# Altium project BLE_Holder.PrjPcb
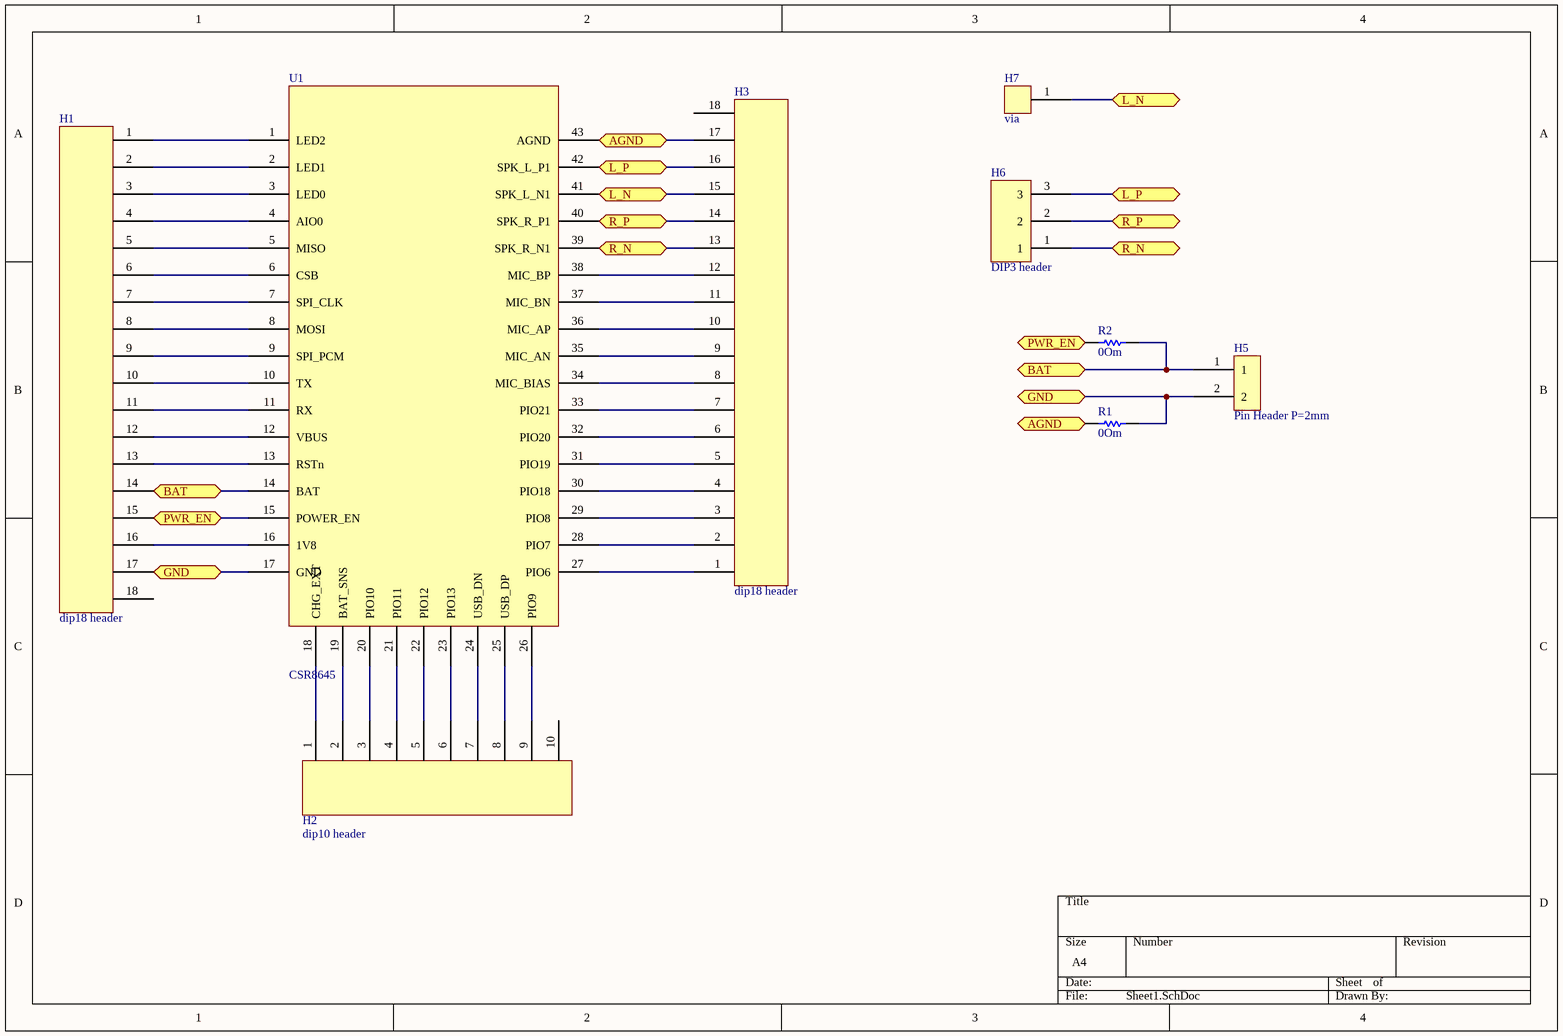
[diagram p0: Sheet1.SchDoc]
1 sheet, 9 parts. Net scope: flat (ports and power ports of the same name join across sheets).
Board file: PCB1.PcbDoc

## Sheet Sheet1.SchDoc
size A4

### Parts
H1  dip18 header  [dip18 header]
H2  dip10 header  [dip10 header]
H3  dip18 header  [dip18 header]
H5  Pin Header P=2mm  [Pin Header P=2mm]
H6  DIP3 header  [DIP3]
H7  via  [via]
R1  0Om  [RESC1608X55X30ML20T10]
R2  0Om  [RESC1608X55X30ML20T10]
U1  CSR8645  [CSR8645]

### Ports
AGND (bidir), BAT (bidir), GND (bidir), L_N (bidir), L_P (bidir), PWR_EN (bidir), R_N (bidir), R_P (bidir)

### Nets
NetH1_1: H1.1 U1.1(LED2)
NetH1_2: H1.2 U1.2(LED1)
NetH1_3: H1.3 U1.3(LED0)
NetH1_4: H1.4 U1.4(AIO0)
NetH1_5: H1.5 U1.5(MISO)
NetH1_6: H1.6 U1.6(CSB)
NetH1_7: H1.7 U1.7(SPI_CLK)
NetH1_8: H1.8 U1.8(MOSI)
NetH1_9: H1.9 U1.9(SPI_PCM)
NetH1_10: H1.10 U1.10(TX)
NetH1_11: H1.11 U1.11(RX)
NetH1_12: H1.12 U1.12(VBUS)
NetH1_13: H1.13 U1.13(RSTn)
NetH1_14: H1.14 H5.1 R2.2 U1.14(BAT) ; port BAT
NetH1_15: H1.15 R2.1 U1.15(POWER_EN) ; port PWR_EN
NetH1_16: H1.16 U1.16(1V8)
NetH1_17: H1.17 H5.2 R1.2 U1.17(GND) ; port GND
NetH2_1: H2.1 U1.18(CHG_EXT)
NetH2_2: H2.2 U1.19(BAT_SNS)
NetH2_3: H2.3 U1.20(PIO10)
NetH2_4: H2.4 U1.21(PIO11)
NetH2_5: H2.5 U1.22(PIO12)
NetH2_6: H2.6 U1.23(PIO13)
NetH2_7: H2.7 U1.24(USB_DN)
NetH2_8: H2.8 U1.25(USB_DP)
NetH2_9: H2.9 U1.26(PIO9)
NetH3_1: H3.1 U1.27(PIO6)
NetH3_2: H3.2 U1.28(PIO7)
NetH3_3: H3.3 U1.29(PIO8)
NetH3_4: H3.4 U1.30(PIO18)
NetH3_5: H3.5 U1.31(PIO19)
NetH3_6: H3.6 U1.32(PIO20)
NetH3_7: H3.7 U1.33(PIO21)
NetH3_8: H3.8 U1.34(MIC_BIAS)
NetH3_9: H3.9 U1.35(MIC_AN)
NetH3_10: H3.10 U1.36(MIC_AP)
NetH3_11: H3.11 U1.37(MIC_BN)
NetH3_12: H3.12 U1.38(MIC_BP)
NetH3_13: H3.13 H6.1 U1.39(SPK_R_N1) ; port R_N
NetH3_14: H3.14 H6.2 U1.40(SPK_R_P1) ; port R_P
NetH3_15: H3.15 H7.1 U1.41(SPK_L_N1) ; port L_N
NetH3_16: H3.16 H6.3 U1.42(SPK_L_P1) ; port L_P
NetH3_17: H3.17 R1.1 U1.43(AGND) ; port AGND

Not connected (* = marked no-connect by the designer): H1 18; H2 10; H3 18

### Library data of the parts
R1 R2 = CMP-2000-01555-1: Part Number: RK73H1JTTD5101F; Manufacturer: KOA Speer